# Altium schematic sheet NCKH cap truong_Thien.SchDoc
size A
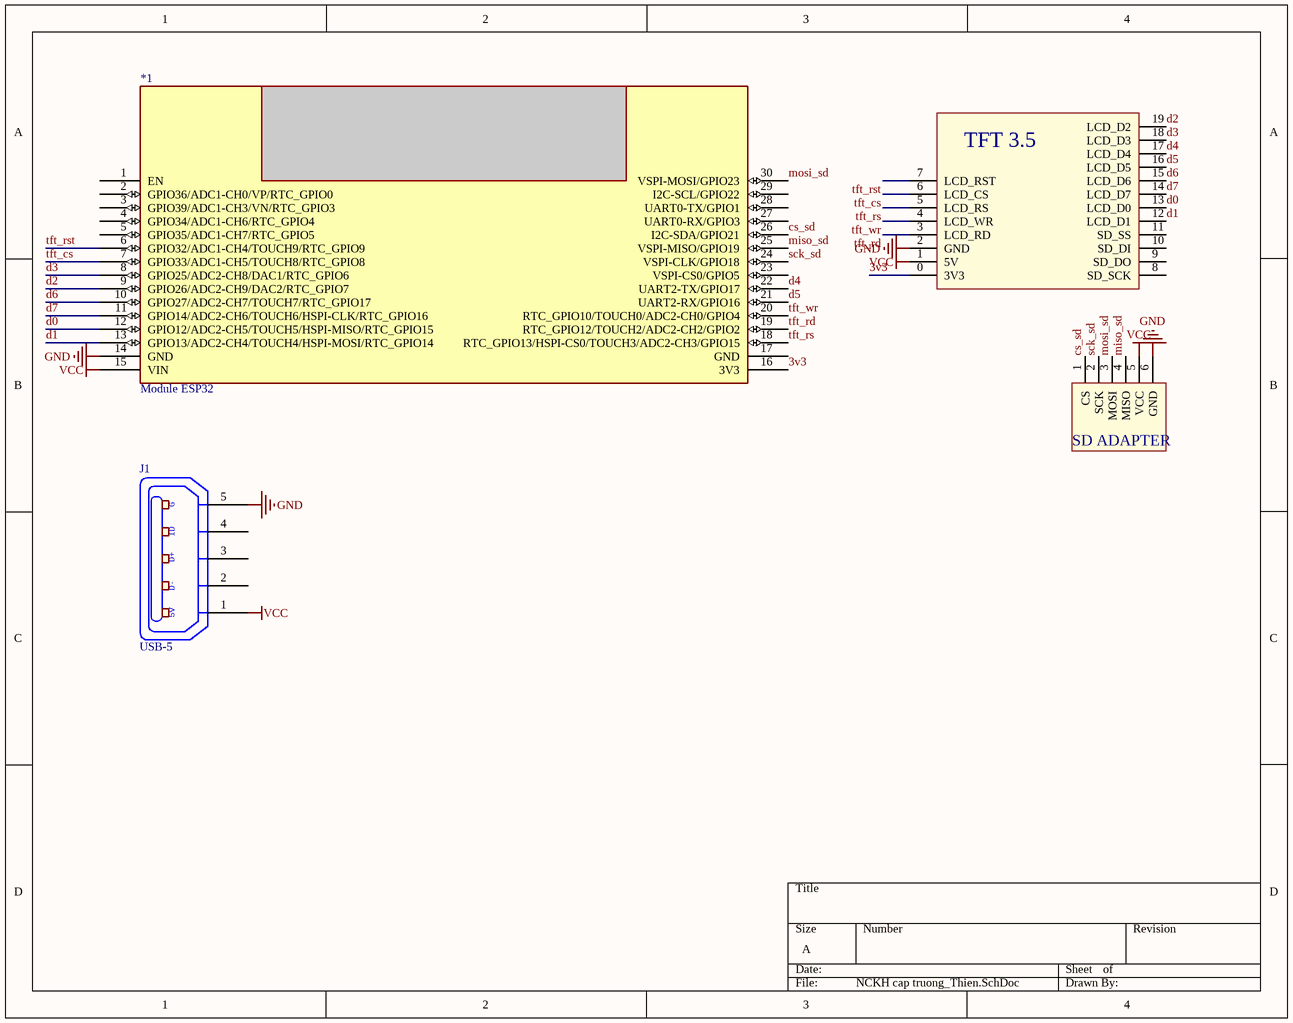
[diagram p0: NCKH cap truong_Thien.SchDoc]

## Parts
*1  Module ESP32  [Module ESP32]
*2  LCD TFT 3.5 Shield  [LCD TFT 3.5 Shield]  (value not drawn)
*3  Module MicroSD Adapter  [Module MicroSD Adapter]  (value not drawn)
J1  USB-5  [USB-M1]

## Nets
GND: *1.14(GND) *2.2(GND) *3.6(GND) J1.5(P5)
VCC: *1.15(VIN) *2.1(5V) *3.5(VCC) J1.1(P1)
3v3: *1.16(3V3) *2.0(3V3)
cs_sd: *1.26(I2C-SDA/GPIO21) *3.1(CS)
d0: *1.12(GPIO12/ADC2-CH5/TOUCH5/HSPI-MISO/RTC_GPIO15) *2.13(LCD_D0)
d1: *1.13(GPIO13/ADC2-CH4/TOUCH4/HSPI-MOSI/RTC_GPIO14) *2.12(LCD_D1)
d2: *1.9(GPIO26/ADC2-CH9/DAC2/RTC_GPIO7) *2.19(LCD_D2)
d3: *1.8(GPIO25/ADC2-CH8/DAC1/RTC_GPIO6) *2.18(LCD_D3)
d4: *1.22(UART2-TX/GPIO17) *2.17(LCD_D4)
d5: *1.21(UART2-RX/GPIO16) *2.16(LCD_D5)
d6: *1.10(GPIO27/ADC2-CH7/TOUCH7/RTC_GPIO17) *2.15(LCD_D6)
d7: *1.11(GPIO14/ADC2-CH6/TOUCH6/HSPI-CLK/RTC_GPIO16) *2.14(LCD_D7)
miso_sd: *1.25(VSPI-MISO/GPIO19) *3.4(MISO)
mosi_sd: *1.30(VSPI-MOSI/GPIO23) *3.3(MOSI)
sck_sd: *1.24(VSPI-CLK/GPIO18) *3.2(SCK)
tft_cs: *1.7(GPIO33/ADC1-CH5/TOUCH8/RTC_GPIO8) *2.6(LCD_CS)
tft_rd: *1.19(RTC_GPIO12/TOUCH2/ADC2-CH2/GPIO2) *2.3(LCD_RD)
tft_rs: *1.18(RTC_GPIO13/HSPI-CS0/TOUCH3/ADC2-CH3/GPIO15) *2.5(LCD_RS)
tft_rst: *1.6(GPIO32/ADC1-CH4/TOUCH9/RTC_GPIO9) *2.7(LCD_RST)
tft_wr: *1.20(RTC_GPIO10/TOUCH0/ADC2-CH0/GPIO4) *2.4(LCD_WR)

Not connected (* = marked no-connect by the designer): *1 1(EN) 2(GPIO36/ADC1-CH0/VP/RTC_GPIO0) 3(GPIO39/ADC1-CH3/VN/RTC_GPIO3) 4(GPIO34/ADC1-CH6/RTC_GPIO4) 5(GPIO35/ADC1-CH7/RTC_GPIO5) 17(GND) 23(VSPI-CS0/GPIO5) 27(UART0-RX/GPIO3) 28(UART0-TX/GPIO1) 29(I2C-SCL/GPIO22); *2 8(SD_SCK) 9(SD_DO) 10(SD_DI) 11(SD_SS); J1 2(P2) 3(P3) 4(P4)

## Notes on the sheet
- (in symbol LCD TFT 3.5 Shield) TFT 3.5
- (in symbol Module MicroSD Adapter) SD ADAPTER
- (in symbol USB-5) G; ID; D+; D-; 5V

## Library data of the parts
J1 = USB-5: Manufacturer: FCI; Manufacturer Part Number: 10118193-0001LF; Connector Type: USB - micro B; Number of Contacts: 5; Gender: Receptacle; Specifications: USB 2.0; .Creator: MM; .Checked PCB: RF; Supplier 1: Digi-Key; RoHS: RoHS Compliant; Category: Connectors, Interconnects; Stock 1: 28642; Pricing 1: 1=0.46, 10=0.433, 25=0.3712, 50=0.3156, 100=0.3032, 250=0.27224, 500=0.25988 (USD); Packaging: Cut Tape (CT); Mounting Type: Surface Mount, Right Angle, Horizontal; Features: Shielded, Solder Retention; Ingress Protection: -; ComponentLink1URL: http://portal.fciconnect.com/Comergent//fci/drawing/10118193.pdf; ComponentLink1Description: http://portal.fciconnect.com/Comergent//fci/drawing/10118193.pdf; Supplier Part Number 1: 609-4616-1-ND; .Checked SCH: MM